# EasyEDA Pro project 步进电机转接板v1.eprj

# Schematic Schematic1
Board Name: Board1; Create Date: 2025-05-28; Page Name: P1; Project Name: 步进电机转接板v1; Schematic Name: Schematic1; Update Date: 2025-05-28; Company: 嘉立创EDA; Drawed: SIRY; Page Size: A4; Version: V1.0
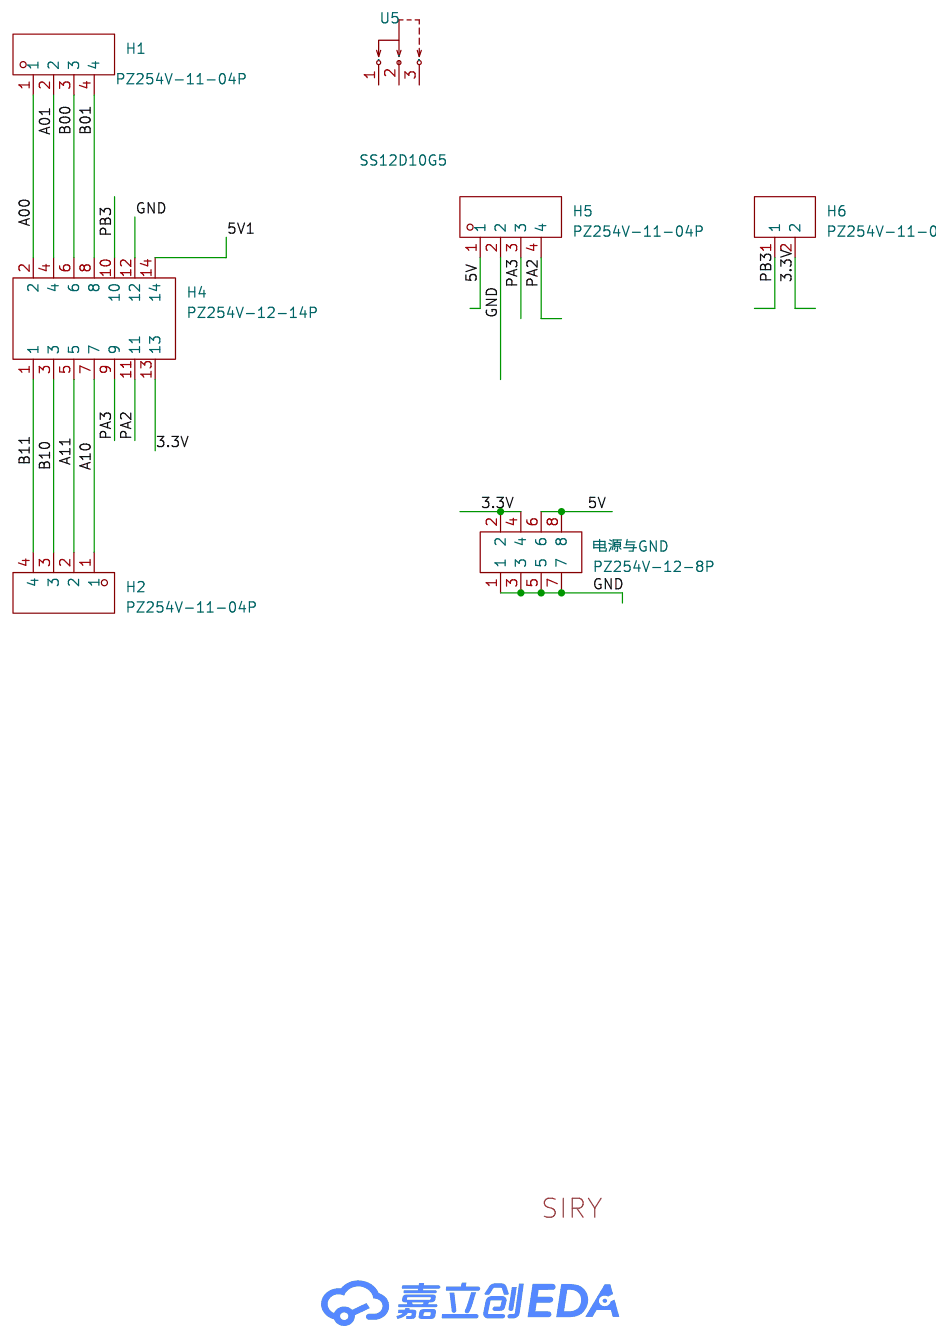
[diagram p0: schematic sheet]

## Parts
H1  PZ254V-11-04P  [HDR-TH_4P-P2.54-V-M]
H2  PZ254V-11-04P  [HDR-TH_4P-P2.54-V-M]
H4  PZ254V-12-14P  [IDC-TH_14P-P2.54_T821114A1S100CEU]
H5  PZ254V-11-04P  [HDR-TH_4P-P2.54-V-M]
H6  PZ254V-11-02P  [HDR-TH_2P-P2.54-V-M]
U5  SS12D10G5  [SW-TH_SHOU-HAN_SS12D10G4]
电源与GND  PZ254V-12-8P  [HDR-TH_8P-P2.54-V-M-R2-C4-S2.54]

## Library data of the parts
H1 H2 H5 = PZ254V-11-04P: 插针结构:1x4P;间距:2.54mm;行距:-;圆针/方针:方针;安装类型:直插;排数:单排;总PIN位数:4P;额定电流:3A;额定电压:250V;配合针长度:6mm;塑高:2.5mm;端接针长度:3mm;触头材质:-;工作温度范围:-40℃~+105℃;颜色:黑色;; LCSC Part Name: 间距:2.54mm 1x4P 直插 方针; Supplier Part: C2691448; Manufacturer: XFCN(兴飞); Supplier Footprint: 插件,P=2.54mm; JLCPCB Part Class: 扩展库; Datasheet: https://atta.szlcsc.com/upload/public/pdf/source/20200309/C492403_F9F19131791D08044AD4F84F8E751A34.pdf; Supplier: LCSC; Pin Structure: 1x4P; Pitch: 2.54mm; Circluar Pins/Square Pins: 方针; Mounting Type: 直插; Number of Rows: 单排; Number of Pins: 4P; Current Rating (Max): 3A; Voltage Rating (Max): 250V; Length of Mating Pin: 6mm; Insulation Height: 2.5mm; Length of End Connection Pin: 3mm; Operating Temperature Range: -40℃~+105℃; Color: 黑色
H4 = PZ254V-12-14P: 插针结构:2x7P;间距:2.54mm;行距:2.54mm;圆针/方针:方针;安装方式:直插;排数:双排;总PIN位数:14P;额定电流:-;额定电压:-;配合针长度:6mm;塑高:2.5mm;端接针长度:3mm;触头材质:黄铜;触头镀层:-;工作温度:-40℃~+105℃;颜色:黑色;; LCSC Part Name: 2x7P 间距:2.54mm 方针 直插; Supplier Part: C492424; Manufacturer: XFCN(兴飞); Supplier Footprint: 插件,P=2.54mm; JLCPCB Part Class: 扩展库; Datasheet: https://atta.szlcsc.com/upload/public/pdf/source/20200309/C492424_D71F2B7B4151908BA6AE7E1F567EA536.pdf; Supplier: LCSC; Pin Structure: 2x7P; Pitch: 2.54mm; Row Spacing: 2.54mm; Circluar Pins/Square Pins: 方针; Mounting Type: 直插; Number of Rows: 双排; Number of Pins: 14P; Length of Mating Pin: 6mm; Insulation Height: 2.5mm; Length of End Connection Pin: 3mm; Contact Material: 黄铜; Operating Temperature: -40℃~+105℃; Color: 黑色
H6 = PZ254V-11-02P: LCSC Part Name: 1x2P 间距:2.54mm 方针 直插; Supplier Part: C492401; Manufacturer: XFCN(兴飞); Supplier Footprint: 插件,P=2.54mm; JLCPCB Part Class: 扩展库; Datasheet: https://atta.szlcsc.com/upload/public/pdf/source/20200309/C492401_A812433581A9B211A7FFA413ADDFF0E5.pdf; Supplier: LCSC; Pin Structure: 1x2P; Pitch: 2.54mm; Circluar Pins/Square Pins: 方针; Mounting Type: 直插; Number of Rows: 单排; Number of Pins: 2P; Length of Mating Pin: 6mm; Insulation Height: 2.5mm; Length of End Connection Pin: 3mm; Contact Material: 黄铜; Operating Temperature: -40℃~+105℃; Color: 黑色
U5 = SS12D10G5: 电路结构:单刀双掷;安装方式:直插;额定电流(DC):2A;额定电压(DC):125V;机械寿命:3千次;; LCSC Part Name: 两档立式插件 3脚拨动开关 柄长5.0mm; Supplier Part: C7431054; Manufacturer: SHOU HAN(首韩); Supplier Footprint: 插件; JLCPCB Part Class: 扩展库; Datasheet: https://atta.szlcsc.com/upload/public/pdf/source/20231130/7A3DB6A149BF0A1DCFFE64FFC07FE434.pdf; Supplier: LCSC; Circuit: 单刀双掷; Switch Length: 12.7mm; Switch Width: 6.7mm; Mounting Style: 直插; Current Rating (DC): 2A; Voltage Rating (DC): 125V; Mechanical Life: 3千次; Operating Temperature: -25℃~+70℃
电源与GND = PZ254V-12-8P: LCSC Part Name: 2x4P 间距:2.54mm 方针 直插; Supplier Part: C492421; Manufacturer: XFCN(兴飞); Supplier Footprint: 插件,P=2.54mm; JLCPCB Part Class: 扩展库; Datasheet: https://atta.szlcsc.com/upload/public/pdf/source/20200309/C492421_DC8A206AF99CD7755BD4A5B0BC48200B.pdf; Supplier: LCSC; Pin Structure: 2x4P; Pitch: 2.54mm; Row Spacing: 2.54mm; Circluar Pins/Square Pins: 方针; Mounting Type: 直插; Number of Rows: 双排; Number of Pins: 8P; Length of Mating Pin: 6mm; Insulation Height: 2.5mm; Length of End Connection Pin: 3mm; Contact Material: 黄铜; Operating Temperature: -40℃~+105℃; Color: 黑色

## Nets
3.3V: H4.13 H6.2 电源与GND.2 电源与GND.4
5V: H5.1 电源与GND.6 电源与GND.8
5V1: H4.14
GND: H4.12 H5.2 电源与GND.1 电源与GND.3 电源与GND.5 电源与GND.7
A00: H1.1 H4.2
A01: H1.2 H4.4
A10: H2.1 H4.7
A11: H2.2 H4.5
B00: H1.3 H4.6
B01: H1.4 H4.8
B10: H2.3 H4.3
B11: H2.4 H4.1
PA2: H4.11 H5.4
PA3: H4.9 H5.3
PB3: H4.10 H6.1

Not connected (* = marked no-connect by the designer): U5 1 2 3

# Board PCB1
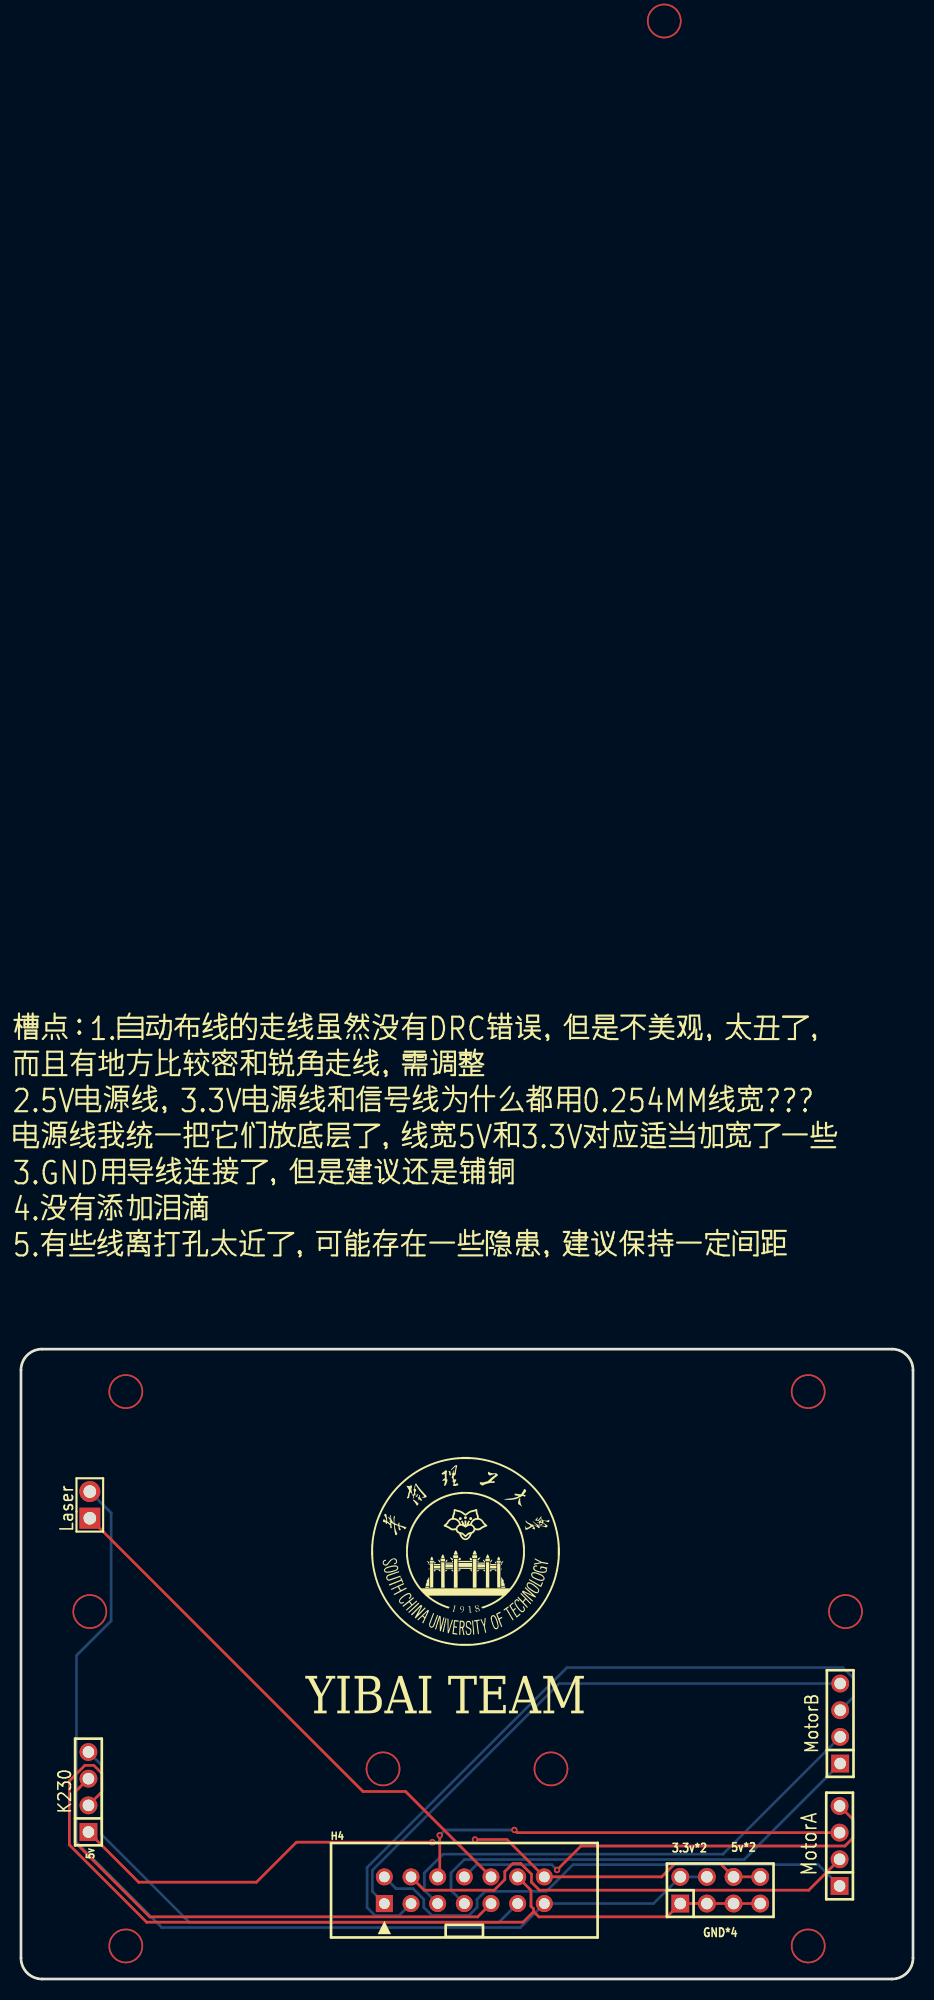
[diagram p1: board, top side]
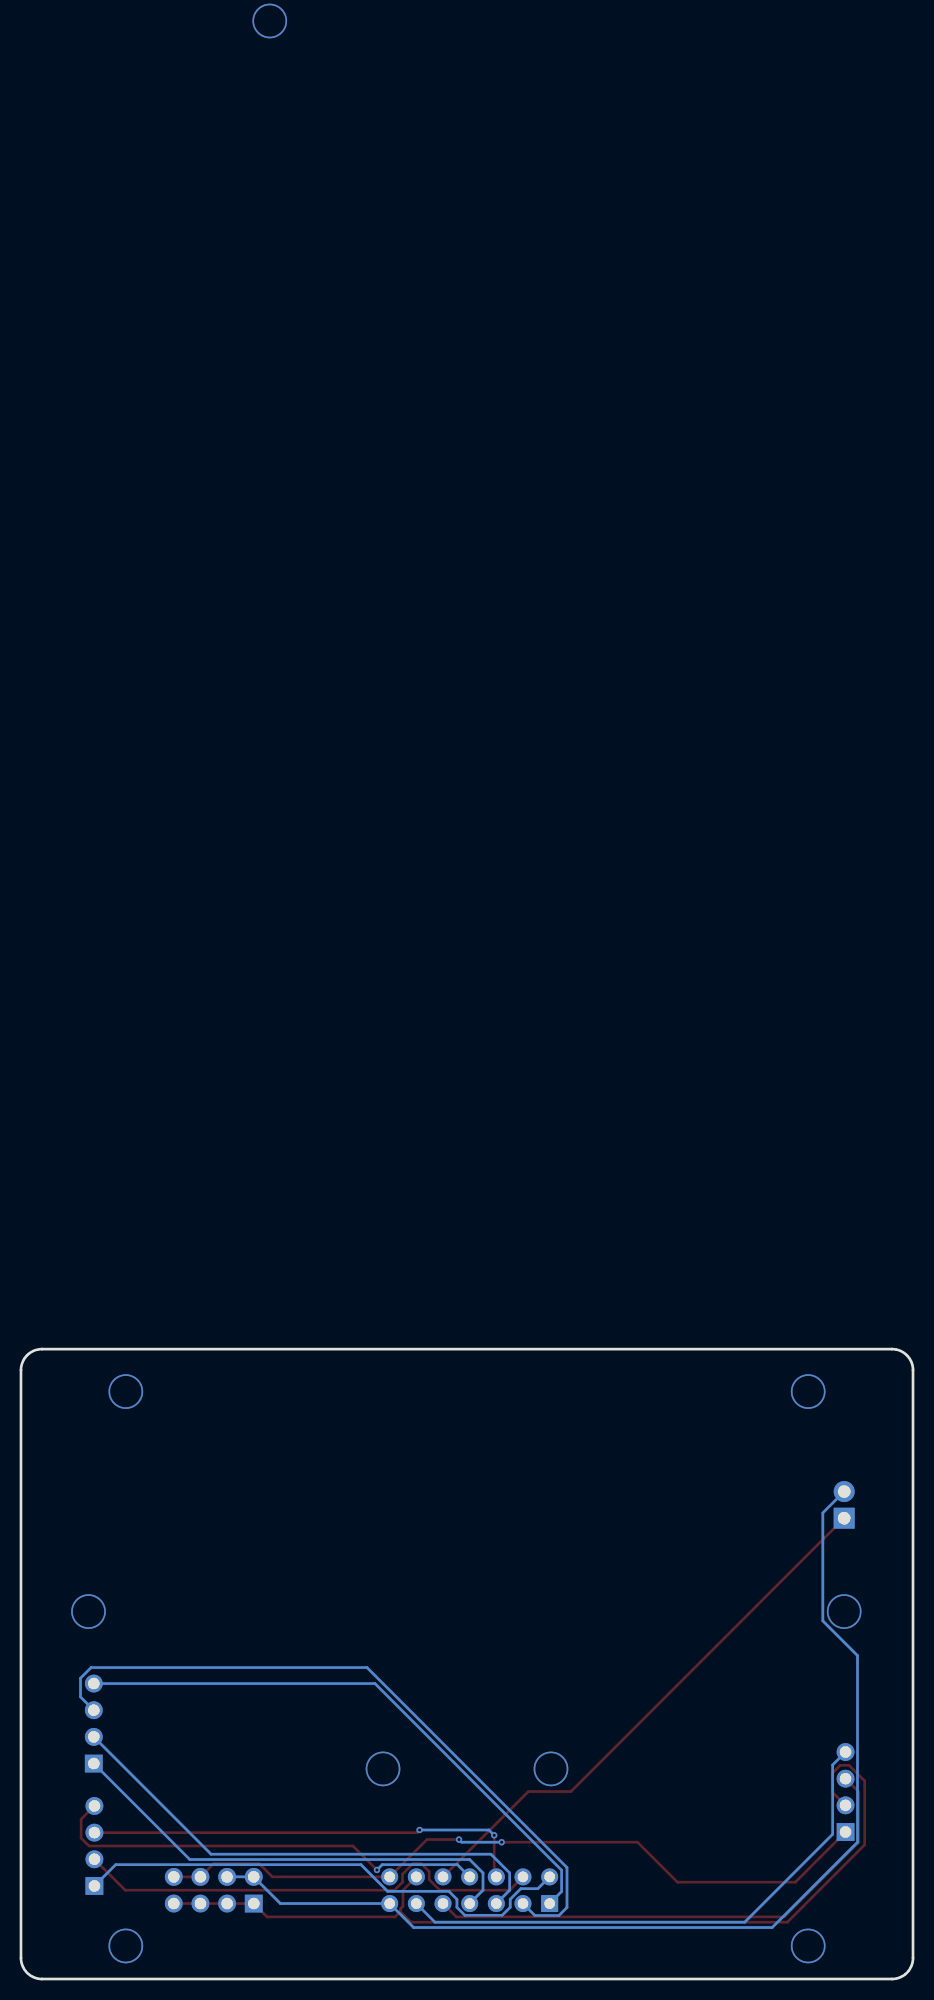
[diagram p2: board, bottom side, seen from below]

Outline 85 x 60 mm; copper layers: Top Layer, Bottom Layer. Coordinates in mm from the lower left corner of the outline.
Outline path: 0,58 0,2 arc(0.59,0.59) 2,0 83,0 arc(84.41,0.59) 85,2 85,58 arc(84.41,59.41) 83,60 2,60 arc(0.59,59.41) 0,58
Stack: Top Layer 0.035mm / Dielectric1 1.51mm FR4 er 4.5 / Bottom Layer 0.035mm

## Design rules (mm)
template: JLCPCB Capability(Two Layers Board)
spacing copperThickness1oz (default): track to track 0.102, other pairs 0.152 to 0.3
spacing copperThickness2oz: track to track 0.203, other pairs 0.152 to 0.3
track width copperThickness1oz (default): min 0.127, default 0.254, max 2.54
track width copperThickness2oz: min 0.203, default 0.254, max 2.54
differential pair differentialPair (default): width min 0.127, default 0.254, max 2.54; gap min 0.152, default 0.152
via viaSize (default): diameter min 0.5, default 0.61, max 10; hole min 0.3, default 0.305, max 6.3

## Placement (name value [footprint] x y rotation side)
H1  PZ254V-11-04P  [HDR-TH_4P-P2.54-V-M]  78 12.67 90 top
H4  PZ254V-12-14P  [IDC-TH_14P-P2.54_T821114A1S100CEU]  42.25 8.46 0 top
H7  PZ254V-12-8P  [HDR-TH_8P-P2.54-V-M-R2-C4-S2.54]  66.63 8.46 0 top
K230  PZ254V-11-04P  [HDR-TH_4P-P2.54-V-M]  6.43 17.81 90 top
Laser  PZ254V-11-02P  [HDR-TH_2P-P2.54-V-M]  6.56 45.16 90 top
MotorB  PZ254V-11-04P  [HDR-TH_4P-P2.54-V-M]  78.06 24.33 90 top

## Footprints (pads in the part's own frame, mm; a bottom-side part is the same pattern mirrored in y, then rotated)
HDR-TH_2P-P2.54-V-M
  rect 2x2 hole 1.2: 1(-1.27,0)
  round 2 hole 1.2: 2(1.27,0)
HDR-TH_4P-P2.54-V-M
  rect 1.7x1.7 hole 1.1: 1(-3.81,0)
  round 1.7 hole 1.1: 2(-1.27,0) 3(1.27,0) 4(3.81,0)
HDR-TH_8P-P2.54-V-M-R2-C4-S2.54
  rect 1.7x1.7 hole 1.1: 1(-3.81,-1.27)
  round 1.7 hole 1.1: 2(-3.81,1.27) 3(-1.27,-1.27) 4(-1.27,1.27) 5(1.27,-1.27) 6(1.27,1.27) 7(3.81,-1.27) 8(3.81,1.27)
IDC-TH_14P-P2.54_T821114A1S100CEU
  rect 1.62x1.62 hole 1.02: 1(-7.62,-1.27)
  round 1.62 hole 1.02: 2(-7.62,1.27) 3(-5.08,-1.27) 4(-5.08,1.27) 5(-2.54,-1.27) 6(-2.54,1.27) 7(0,-1.27) 8(0,1.27) 9(2.54,-1.27) 10(2.54,1.27) 11(5.08,-1.27) 12(5.08,1.27) 13(7.62,-1.27) 14(7.62,1.27)

## Nets
3.3V: H4.13 H7.2 H7.4 Laser.2
5V: H4.14 H7.6 H7.8 K230.1
GND: H4.12 H7.1 H7.3 H7.5 H7.7 K230.2
A00: H1.1 H4.2
A01: H1.2 H4.4
A10: H4.7 MotorB.1
A11: H4.5 MotorB.2
B00: H1.3 H4.6
B01: H1.4 H4.8
B10: H4.3 MotorB.3
B11: H4.1 MotorB.4
PA2: H4.11 K230.4
PA3: H4.9 K230.3
PB3: H4.10 Laser.1

## Via types
v1: diameter 3.3, hole 3, Top Layer to Bottom Layer, 9 vias
v2: diameter 0.61, hole 0.305, Top Layer to Bottom Layer, 5 vias

## Routing (per net, layer and track width the routed paths; a pad name or vN(x,y) marks a point on that pad's centre or on a via; arc(x,y) is an arc through that point)
3.3V: length 101
  Bottom Layer w0.254: Laser.2 8.59,44.4 8.59,34.11 5.29,30.81 5.29,13.03 13.42,4.9 47.58,4.9 H4.13 60.28,7.19 62.82,9.73 65.36,9.73
5V: length 70.2
  Top Layer w0.254: v2(39.2,13.03) 26.24,13.03 22.43,9.22 11.21,9.22 K230.1 ; 70.44,9.73 67.9,9.73 66.63,11 62.31,11 61.04,9.73 49.87,9.73 46.31,13.28 v2(43.26,13.28)
  Bottom Layer w0.254: v2(39.2,13.03) 43.01,13.03 v2(43.26,13.28)
GND: length 87.7
  Top Layer w0.254: H7.7 H7.5 H7.3 H7.1 61.55,5.92 49.36,5.92 48.85,6.43 ; 48.85,6.43 47.83,5.41 11.97,5.41 4.61,12.78 4.61,18.87 6.09,20.35 6.94,20.35 7.7,19.59 7.7,17.81 K230.2 ; 48.85,6.43 48.85,6.68 48.6,6.93 48.6,8.46 47.33,9.73
(no net):
  vias: v1(6.56,35) v1(9.99,55.95) v1(9.99,3.15) v1(34.5,20.01) v1(50.5,20.01) v1(61.3,186.51) v1(75.01,55.95) v1(75.01,3.15) v1(78.57,35)
A00: length 48.6
  Bottom Layer w0.254: H1.1 75.97,10.89 52.6,10.89 50.06,8.35 44.22,8.35 43.46,7.59 43.46,6.83 42.7,6.07 39.14,6.07 38.38,6.83 38.38,7.59 37.36,8.61 35.75,8.61 34.63,9.73
A01: length 45.6
  Top Layer w0.254: 37.17,9.73 38.44,8.46 45.09,8.46 46.1,9.47 46.1,10.23 46.87,11 47.63,11 48.64,9.98 48.64,9.22 49.41,8.46 75.06,8.46 H1.2
A10: length 44.8
  Bottom Layer w0.254: MotorB.1 68.92,11.38 42.25,11.38 40.98,10.11 40.98,8.46 H4.7
A11: length 48.4
  Bottom Layer w0.254: MotorB.2 66.88,11.89 40.21,11.89 38.44,10.11 38.44,8.46 H4.5
B00: length 42.5
  Top Layer w0.254: 39.71,9.73 39.9,9.92 v2(39.9,13.69) ; v2(47.02,14.2) 47.27,13.94 H1.3
  Bottom Layer w0.254: v2(47.02,14.2) 40.41,14.2 v2(39.9,13.69)
B01: length 42.6
  Top Layer w0.254: v2(51.08,10.39) 53.37,12.67 78.51,12.67 79.27,13.43 79.27,15.21 H1.4
  Bottom Layer w0.254: v2(51.08,10.39) 50.57,10.89 43.41,10.89 42.25,9.73
B10: length 67
  Bottom Layer w0.254: H4.3 36.02,6.04 33.74,6.04 32.97,6.81 32.97,10.62 52.03,29.67 78.31,29.67 79.33,28.65 79.33,26.87 MotorB.3
B11: length 55.6
  Bottom Layer w0.254: MotorB.4 51.26,28.14 33.48,10.36 33.48,8.33 H4.1
PA2: length 52.2
  Bottom Layer w0.254: K230.4 7.66,20.39 7.66,13.79 16.04,5.41 45.55,5.41 H4.11
PA3: length 49.7
  Top Layer w0.254: H4.9 43.52,5.92 12.27,5.92 5.16,13.03 5.16,17.81 K230.3
PB3: length 52.4
  Top Layer w0.254: Laser.1 32.59,17.86 36.66,17.86 44.79,9.73

## Text on the board
Top Silkscreen Layer: 5v | 3.3v*2 | GND*4 | 5v*2 | MotorA | YIBAI TEAM | 槽点：1.自动布线的走线虽然没有DRC错误，但是不美观，太丑了， / 而且有地方比较密和锐角走线，需调整 / 2.5V电源线，3.3V电源线和信号线为什么都用0.254MM线宽??? / 电源线我统一把它们放底层了，线宽5V和3.3V对应适当加宽了一些 / 3.GND用导线连接了，但是建议还是铺铜 / 4.没有添加泪滴 / 5.有些线离打孔太近了，可能存在一些隐患，建议保持一定间距

# Board PCB2【个人优化
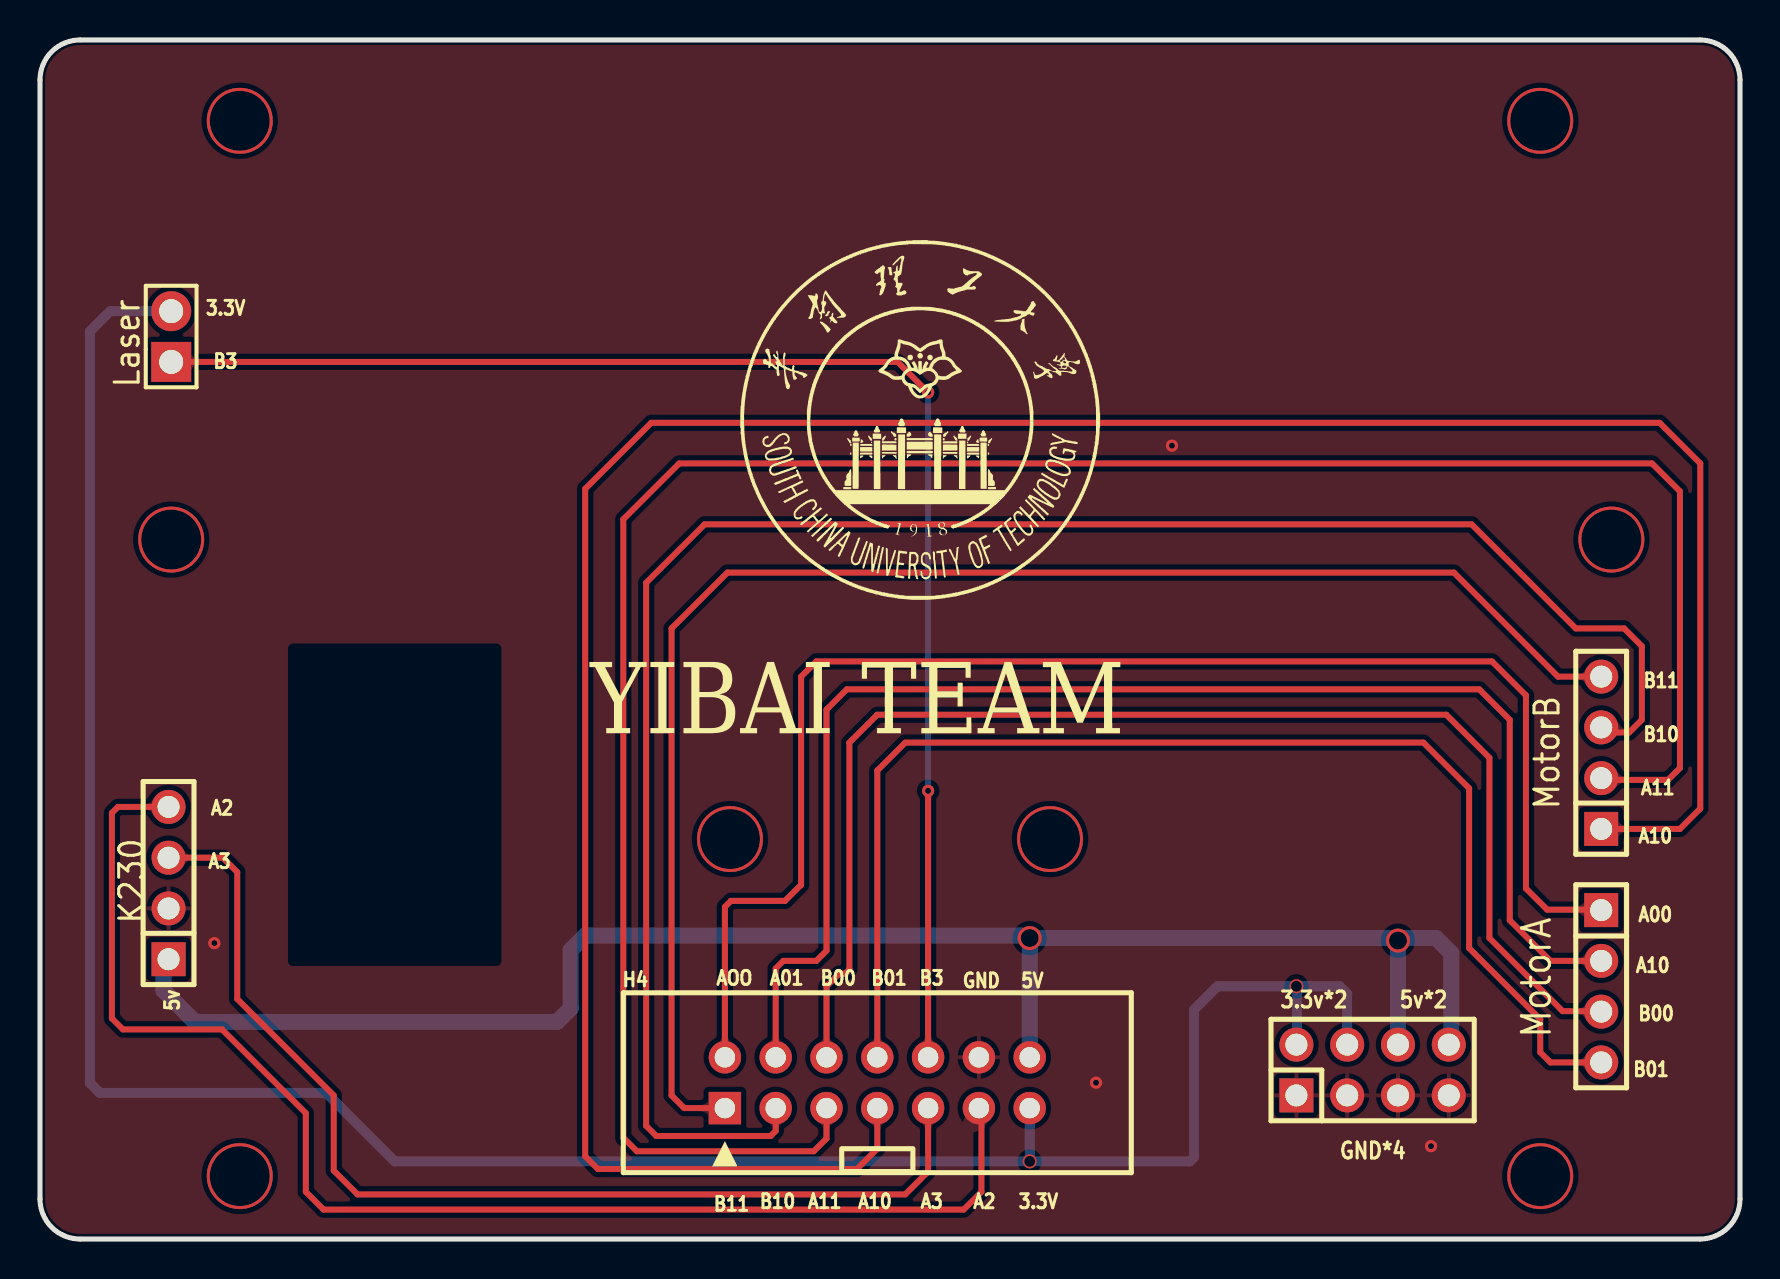
[diagram p3: board, top side]
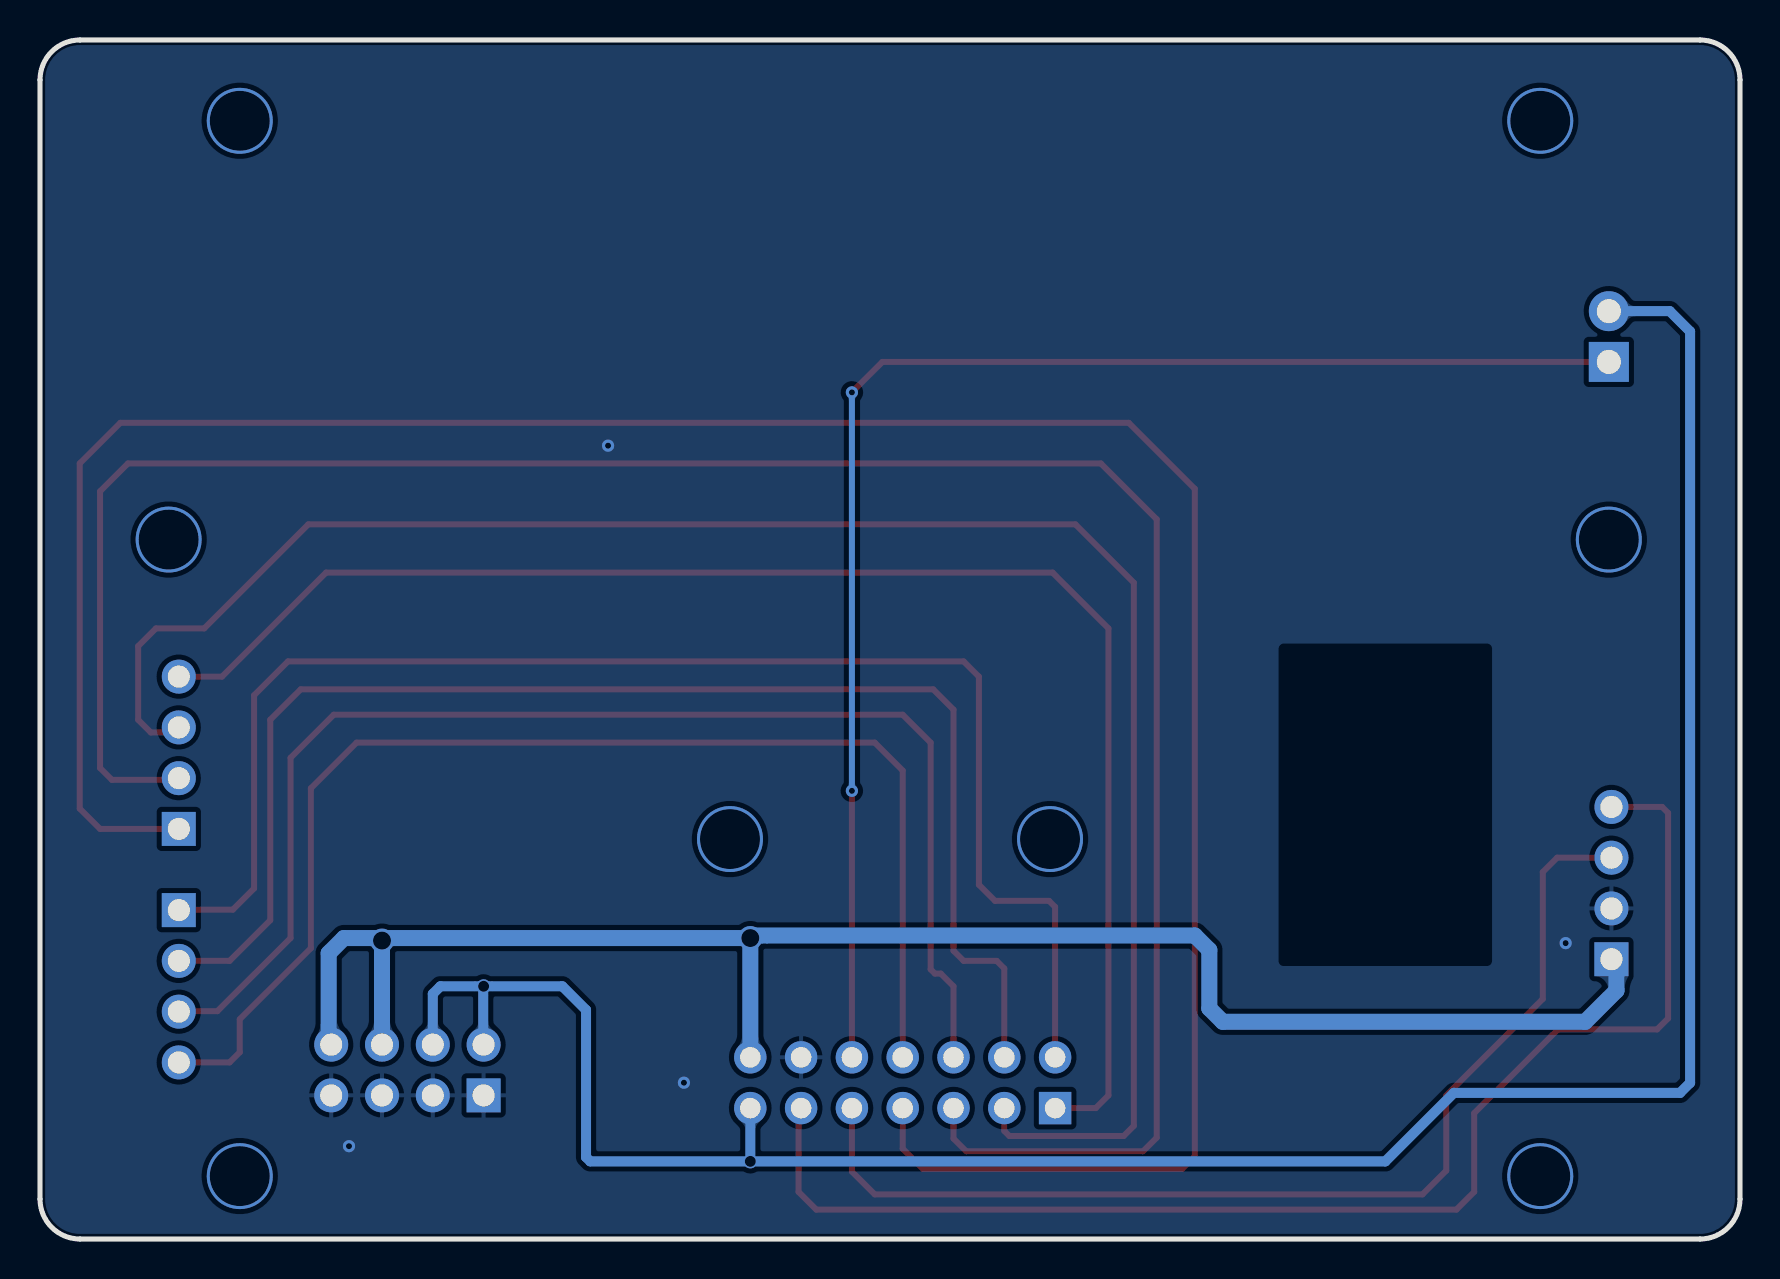
[diagram p4: board, bottom side, seen from below]

Outline 85 x 60 mm; copper layers: Top Layer, Bottom Layer. Coordinates in mm from the lower left corner of the outline.
Outline path: 0,58 0,2 arc(0.59,0.59) 2,0 83,0 arc(84.41,0.59) 85,2 85,58 arc(84.41,59.41) 83,60 2,60 arc(0.59,59.41) 0,58
Stack: Top Layer 0.035mm / Dielectric1 1.51mm FR4 er 4.5 / Bottom Layer 0.035mm

## Design rules (mm)
template: 自定义配置
spacing copperThickness1oz (default): track to track 0.102, other pairs 0.152 to 0.3
spacing copperThickness2oz: track to track 0.203, other pairs 0.152 to 0.3
track width copperThickness1oz (default): min 0.3, default 0.3, max 2.54
track width copperThickness2oz: min 0.203, default 0.254, max 2.54
differential pair differentialPair (default): width min 0.127, default 0.254, max 2.54; gap min 0.152, default 0.152
via viaSize (default): diameter min 0.5, default 0.61, max 10; hole min 0.3, default 0.305, max 6.3

## Placement (name value [footprint] x y rotation side)
H1  PZ254V-11-04P  [HDR-TH_4P-P2.54-V-M]  78.06 12.65 270 top
H4  PZ254V-12-14P  [IDC-TH_14P-P2.54_T821114A1S100CEU]  41.86 7.82 0 top
H7  PZ254V-12-8P  [HDR-TH_8P-P2.54-V-M-R2-C4-S2.54]  66.63 8.46 0 top
K230  PZ254V-11-04P  [HDR-TH_4P-P2.54-V-M]  6.43 17.81 90 top
Laser  PZ254V-11-02P  [HDR-TH_2P-P2.54-V-M]  6.56 45.16 90 top
MotorB  PZ254V-11-04P  [HDR-TH_4P-P2.54-V-M]  78.06 24.33 90 top

## Footprints (pads in the part's own frame, mm; a bottom-side part is the same pattern mirrored in y, then rotated)
HDR-TH_2P-P2.54-V-M
  rect 2x2 hole 1.2: 1(-1.27,0)
  round 2 hole 1.2: 2(1.27,0)
HDR-TH_4P-P2.54-V-M
  rect 1.7x1.7 hole 1.1: 1(-3.81,0)
  round 1.7 hole 1.1: 2(-1.27,0) 3(1.27,0) 4(3.81,0)
HDR-TH_8P-P2.54-V-M-R2-C4-S2.54
  rect 1.7x1.7 hole 1.1: 1(-3.81,-1.27)
  round 1.7 hole 1.1: 2(-3.81,1.27) 3(-1.27,-1.27) 4(-1.27,1.27) 5(1.27,-1.27) 6(1.27,1.27) 7(3.81,-1.27) 8(3.81,1.27)
IDC-TH_14P-P2.54_T821114A1S100CEU
  rect 1.62x1.62 hole 1.02: 1(-7.62,-1.27)
  round 1.62 hole 1.02: 2(-7.62,1.27) 3(-5.08,-1.27) 4(-5.08,1.27) 5(-2.54,-1.27) 6(-2.54,1.27) 7(0,-1.27) 8(0,1.27) 9(2.54,-1.27) 10(2.54,1.27) 11(5.08,-1.27) 12(5.08,1.27) 13(7.62,-1.27) 14(7.62,1.27)

## Nets
3.3V: H4.13 H7.2 H7.4 Laser.2
5V: H4.14 H7.6 H7.8 K230.1
GND: H4.12 H7.1 H7.3 H7.5 H7.7 K230.2
A00: H1.1 H4.2
A01: H1.2 H4.4
A10: H4.7 MotorB.1
A11: H4.5 MotorB.2
B00: H1.3 H4.6
B01: H1.4 H4.8
B10: H4.3 MotorB.3
B11: H4.1 MotorB.4
PA2: H4.11 K230.4
PA3: H4.9 K230.3
PB3: H4.10 Laser.1

## Via types
v1: diameter 3.3, hole 3, Top Layer to Bottom Layer, 8 vias
v2: diameter 0.7, hole 0.55, Top Layer to Bottom Layer, 2 vias
v3: diameter 1.2, hole 0.9, Top Layer to Bottom Layer, 2 vias
v4: diameter 0.61, hole 0.305, Top Layer to Bottom Layer, 6 vias

## Routing (per net, layer and track width the routed paths; a pad name or vN(x,y) marks a point on that pad's centre or on a via; arc(x,y) is an arc through that point)
3.3V: length 123.2
  Bottom Layer w0.3: 62.78,9.77 62.82,9.73
  Bottom Layer w0.5: v2(49.48,3.88) 57.49,3.88 57.7,4.1 57.7,11.46 58.88,12.65 v2(62.82,12.65) ; v2(49.48,3.88) H4.13 ; v2(49.48,3.88) 17.73,3.88 14.31,7.31 2.99,7.31 2.49,7.81 2.49,45.41 3.51,46.43 Laser.2 ; v2(62.82,12.65) 62.84,12.63 62.84,9.83 62.78,9.77 62.78,9.56 62.69,9.47 ; v2(62.82,12.65) 64.98,12.65 65.36,12.27 65.36,9.73
5V: length 86.5
  Bottom Layer w0.8: v3(67.9,14.93) 68.03,15.06 69.81,15.06 70.57,14.3 70.57,9.85 70.44,9.73 ; v3(67.9,14.93) 67.9,9.73 ; v3(67.9,14.93) 67.77,15.06 v3(49.48,15.06) ; v3(49.48,15.06) 49.36,15.19 27.26,15.19 26.53,14.46 26.53,11.54 25.86,10.87 7.74,10.87 6.18,12.43 6.18,13.75 K230.1 ; v3(49.48,15.06) H4.14
GND:
  vias: v4(8.72,14.81) v4(52.8,7.82) v4(56.6,39.7) v4(69.55,4.65)
(no net):
  vias: v1(6.56,35) v1(9.99,55.95) v1(9.99,3.15) v1(34.5,20.01) v1(50.5,20.01) v1(75.01,55.95) v1(75.01,3.15) v1(78.57,35)
A00: length 73.3
  Top Layer w0.3: 78,16.48 75.36,16.48 74.3,17.54 74.3,27.21 72.6,28.9 38.82,28.9 38.06,28.14 38.06,17.73 37.25,16.92 34.54,16.92 34.25,16.62 H4.2
A01: length 70
  Top Layer w0.3: 78,13.94 77.98,13.92 75.52,13.92 73.49,15.95 73.49,25.98 71.96,27.51 40.34,27.51 39.32,26.49 39.32,14.43 38.82,13.92 37.17,13.92 36.78,13.54 H4.4
A10: length 131.3
  Top Layer w0.3: H4.7 41.86,4.52 40.85,3.5 27.89,3.5 27.26,4.14 27.26,37.54 30.56,40.84 80.98,40.84 83.01,38.81 83.01,21.54 82,20.52 MotorB.1
A11: length 115.8
  Top Layer w0.3: H4.5 39.32,5.03 38.69,4.39 29.84,4.39 29.16,5.07 29.16,36.02 31.96,38.81 80.6,38.81 82,37.41 82,23.57 81.4,22.98 78.14,22.98 MotorB.2
B00: length 65.9
  Top Layer w0.3: H4.6 39.32,12.65 39.96,13.28 40.26,13.28 40.47,13.49 40.47,24.84 41.86,26.24 70.31,26.24 72.47,24.08 72.47,15.06 76.13,11.4 78,11.4
B01: length 63.4
  Top Layer w0.3: H1.4 75.52,8.84 75.01,9.35 75.01,11 71.46,14.55 71.46,22.55 69.17,24.84 43.26,24.84 41.86,23.44 H4.8
B10: length 94.7
  Top Layer w0.3: MotorB.3 78.31,25.35 79.46,25.35 80.09,25.98 80.09,29.67 79.2,30.55 76.79,30.55 71.58,35.76 33.23,35.76 30.31,32.84 30.31,5.66 30.82,5.16 36.53,5.16 36.78,5.41 H4.3
B11: length 76.1
  Top Layer w0.3: MotorB.4 75.9,28.14 70.69,33.35 34.37,33.35 31.58,30.55 31.58,7.19 32.21,6.55 H4.1
PA2: length 67.6
  Top Layer w0.3: K230.4 3.89,21.62 3.59,21.32 3.59,11.04 4.15,10.49 9.1,10.49 13.29,6.3 13.29,2.36 14.18,1.47 46.18,1.47 47.07,2.36 47.07,6.42 H4.11
PA3: length 54.5
  Top Layer w0.3: H4.9 44.41,3.38 43.26,2.23 15.88,2.23 14.69,3.42 14.69,7.19 9.86,12.01 9.86,18.36 9.14,19.08 K230.3
PB3: length 71.8
  Top Layer w0.3: v4(44.41,42.37) 42.88,43.89 Laser.1 ; H4.10 v4(44.41,22.43)
  Bottom Layer w0.3: v4(44.41,22.43) v4(44.41,42.37)

## Copper pours and planes (outline as drawn; the poured copper is in the pictures)
GND on Top Layer: -5,63.32 90.25,63.32 90.25,-4.24 -5,-4.24
GND on Bottom Layer: -5,62.94 90.89,62.94 90.89,-5.55 -5,-5.55

Small or netless copper shapes (teardrops, artwork), in the pictures only: 24 on Top Layer, 22 on Bottom Layer

## Text on the board
Top Silkscreen Layer: 5v | 3.3V | A3 | A2 | B3 | B11 | AOO | B10 | A01 | A11 | B00 | A10 | B01 | GND | 5V | A00 | 3.3v*2 | GND*4 | 5v*2 | MotorA | YIBAI TEAM
